# EAGLE design temperatureSensor (EAGLE 6.2)
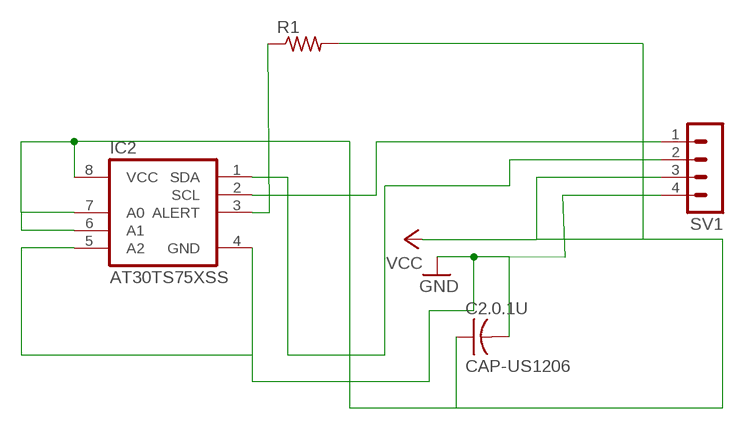
[diagram p0: schematic, sheet 1]

## Parts
C2.0.1U  CAP-US1206  [C1206]
IC2  AT30TS75XSS  [SO8]
R1  RES-US1206  [R1206]
SV1  MA04-1  [MA04-1]

## Nets
D2: IC2.3(ALERT) R1.1
GND: C2.0.1U.2 IC2.4(GND) IC2.5(A2) SV1.4
N$4: IC2.2(SCL) SV1.1
SDA: IC2.1(SDA) SV1.2
VCC: C2.0.1U.1 IC2.6(A1) IC2.7(A0) IC2.8(VCC) R1.2 SV1.3

## Library data of the parts
C2.0.1U = fab:CAP-US
IC2 = atmel-at30ts75x:AT30TS75X: The Atmel® AT30TSE750A/AT30TSE752A/754A/758A are a complete, precise temperature monitoring device designed for use in a variety of applications that require the measuring of local temperatures as an integral part of the system's function and/or reliability. The AT30TSE752A/754A/758A devices combine a high-precision digital temperature sensor, programmable high and low temperature alarms, and a 2-wire I2C and SMBus (System Management Bus) compatible serial interface into a single, compact package. The temperature sensor can measure temperatures over the full -55C to +125C temperature range and has a typical accuracy as precise as ±0.5C from 0C to +85C. The result of the digitized temperature measurements are stored in one of the AT30TS75xA internal registers, which is readable at any time through the device's serial interface. X=0 no EEPROM; 2--2 kb; 4 --4 kb; 8 --8 kb The library has been designed by Richard Magdycz <https://www.facebook.com/groups/eaglecadsoftUK>
R1 = fab:RES-US: Resistor (US Symbol) Variants with postfix FAB are widened to allow the routing of internal traces
SV1 = con-lstb:MA04-1: PIN HEADER; OC_FARNELL: unknown; OC_NEWARK: unknown

## Net classes
0 default: width 0.203 mm, drill 0.33 mm, clearance 0.203 mm

## Board
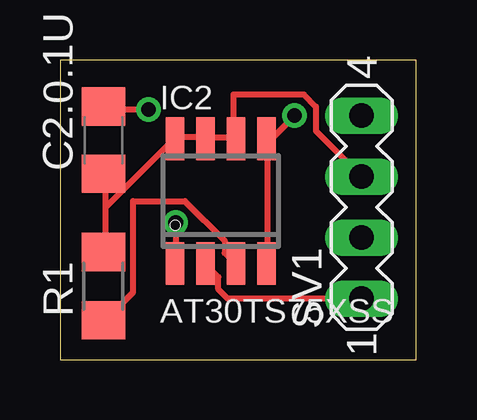
[diagram p1: board, top side]
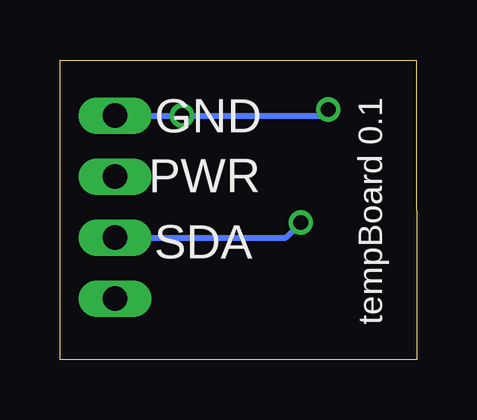
[diagram p2: board, bottom side, seen from below]

Size 14.84 x 12.48 mm. Coordinates in mm from the lower left corner, seen from the top.
Outline: 0,0 14.84,0 14.84,12.48 0.02,12.48 0,0
Copper layers (1*16): Top 0.035mm / dielectric 1.5mm / Bottom 0.035mm
Design rules "default": minimum track width 10mil, minimum drill 24mil, track to track 8mil, track to pad 8mil, pad to pad 8mil, via to via 8mil, smd to smd 8mil, copper to edge 40mil, drill to drill 8mil, minimum pad ring 10mil, minimum via ring 8mil, stop-mask expansion 4mil, vias tented up to drill 0mil, thermal gap 10mil

### Footprints (pad centres in the part's own frame; a part is rotated, then mirrored left to right if it is on the bottom)
C1206 = smd 1.6 x 1.8: 1 -1.4,0; 2 1.4,0
SO8 = smd 0.762 x 1.778: 1 -1.905,-2.6; 2 -0.635,-2.6; 3 0.635,-2.6; 4 1.905,-2.6; 5 1.905,2.6; 6 0.635,2.6; 7 -0.635,2.6; 8 -1.905,2.6
R1206 = smd 1.6 x 1.803: 1 -1.422,0; 2 1.422,0
MA04-1 = drill 1.016 long: 1 -3.81,0; 2 -1.27,0; 3 1.27,0; 4 3.81,0

### Placement (x,y rotation side)
C2.0.1U  1.81,9.14 90 top
IC2  6.7,6.6 0 top
R1  1.81,3.06 90 top
SV1  12.57,6.35 90 top

### Tracks (layer width: path | path; a pad name or v marks a point on that pad's centre or on a via)
D2
  Top 0.254: IC2.3 7.24,4.06 6.85,4.45 6.85,4.95 5.2,6.6 3.04,6.6 3.04,2.79 1.9,1.65 R1.1
GND  (via drill 0.61)
  Top 0.254: IC2.4 8.63,4.06 8.63,9.14 IC2.5 8.76,9.14 v9.78,10.16 | v3.68,10.41 1.9,10.41 C2.0.1U.2
  Bottom 0.254: v3.68,10.41 3.93,10.16 v9.78,10.16 SV1.4
N$4
  Top 0.254: SV1.1 6.98,2.54 6.6,2.92 6.6,3.43 6.09,3.94 IC2.2
SDA  (via drill 0.61)
  Top 0.254: v4.82,5.72 4.82,4.06 IC2.1
  Bottom 0.254: v4.82,5.72 5.46,5.08 SV1.2
VCC
  Top 0.254: 1.9,6.35 1.9,4.57 R1.2 | 1.9,6.35 1.9,7.62 C2.0.1U.1 | 1.9,6.35 4.7,9.14 IC2.8 4.82,9.27 5.97,9.27 IC2.7 6.09,9.27 7.24,9.27 IC2.6 7.24,9.4 7.24,11.05 10.16,11.05 10.67,10.54 10.67,9.52 SV1.3

### Text on the board
bPlace: GND | PWR | SDA | tempBoard 0.1
tValues: R1 10K